# EAGLE design capstone electrical circuit (EAGLE 9.6.2)
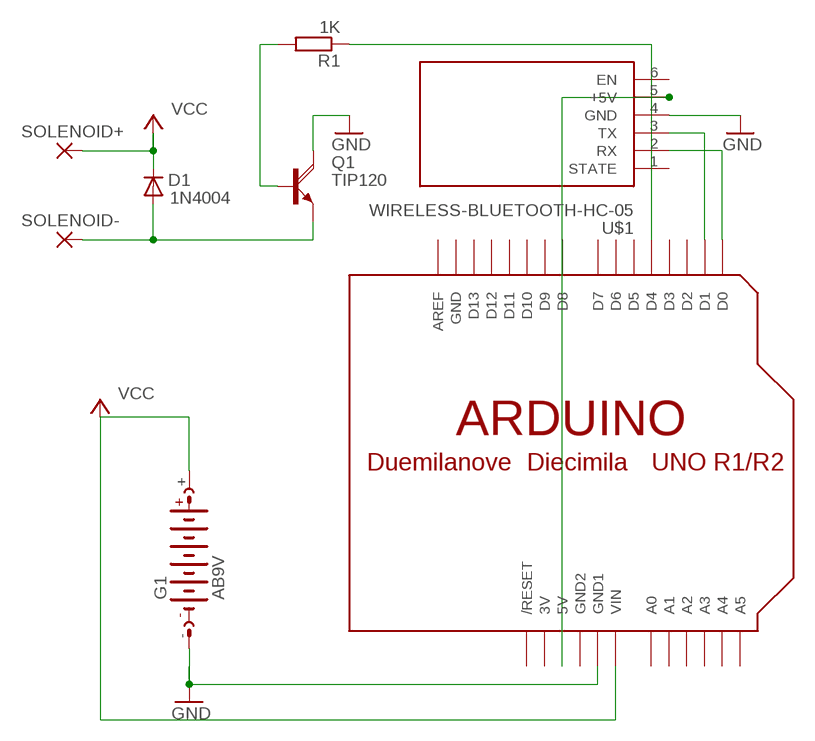
[diagram p0: schematic, sheet 1]

## Parts
D1  1N4004  [DO41-10]
G1  AB9V  [AB9V]
Q1  TIP120  [TO220AH]
R1  1K  R-EU_0207/10  [0207/10]
SOLENOID+  WIREPAD2,54/1,0  [2,54/1,0]
SOLENOID-  WIREPAD2,54/1,0  [2,54/1,0]
U$1  WIRELESS-BLUETOOTH-HC-05  [WIRELESS-BLUETOOTH-HC-05]
U$2  ARDUINOUNO  [ARDUINO]

## Nets
GND: G1.- Q1.C U$1.4(GND) U$2.GND1
N$1: U$1.2(RX) U$2.D0
N$2: U$1.3(TX) U$2.D1
N$3: D1.A Q1.E SOLENOID-.1(P)
N$4: U$1.5(+5V) U$2.5V
N$5: Q1.B R1.2
N$6: R1.1 U$2.D4
VCC: D1.C G1.+ SOLENOID+.1(P) U$2.VIN
Unconnected: U$1.1(STATE) U$1.6(EN) U$2.A0 U$2.A1 U$2.A2 U$2.A3 U$2.A4 U$2.A5 U$2.AREF U$2.D2 U$2.D3 U$2.D5 U$2.D6 U$2.D7 U$2.D8 U$2.D9 U$2.D10 U$2.D11 U$2.D12 U$2.D13 U$2.RESET(/RESET)

## Power pins joined to a net without a drawn wire
3V: U$2.3V
GND: U$2.GND
GND2: U$2.GND2

## Library data of the parts
D1 = adafruit:1N4004: DIODE General purpose 1N400x type rectifier (With bigger pads) http://www.ladyada.net/library/pcb/eaglelibrary.html
G1 = battery:AB9V: 9-V BATTERY CLIP
Q1 = transistor-power:TIP120: NPN DARLINGTON TRANSISTOR
R1 = rcl:R-EU_: RESISTOR, European symbol; SPICEPREFIX: R
SOLENOID+ SOLENOID- = wirepad:WIREPAD: Wire PAD connect wire on PCB
U$1 = diy-modules:WIRELESS-BLUETOOTH-HC-05: Bluetooth Transceiver Module based on HC-05 board Tutorial is available here: https://arduino-info.wikispaces.com/BlueTooth-HC05-HC06-Modules-How-To Click here to find device on ebay.com <http://www.ebay.com/sch/hc-05+module+rs232>
U$2 = adafruit:ARDUINO: Arduino Diecimila/Duemilanove Make a shield with ease, this package has all the named pins as well as the two mounting drill holes and an outline of the USB and DC power connector. The outline is on the DIMENSION layer, so if your board house uses it they will cut the outline to match. http://www.ladyada.net/library/pcb/eaglelibrary.html

## Board
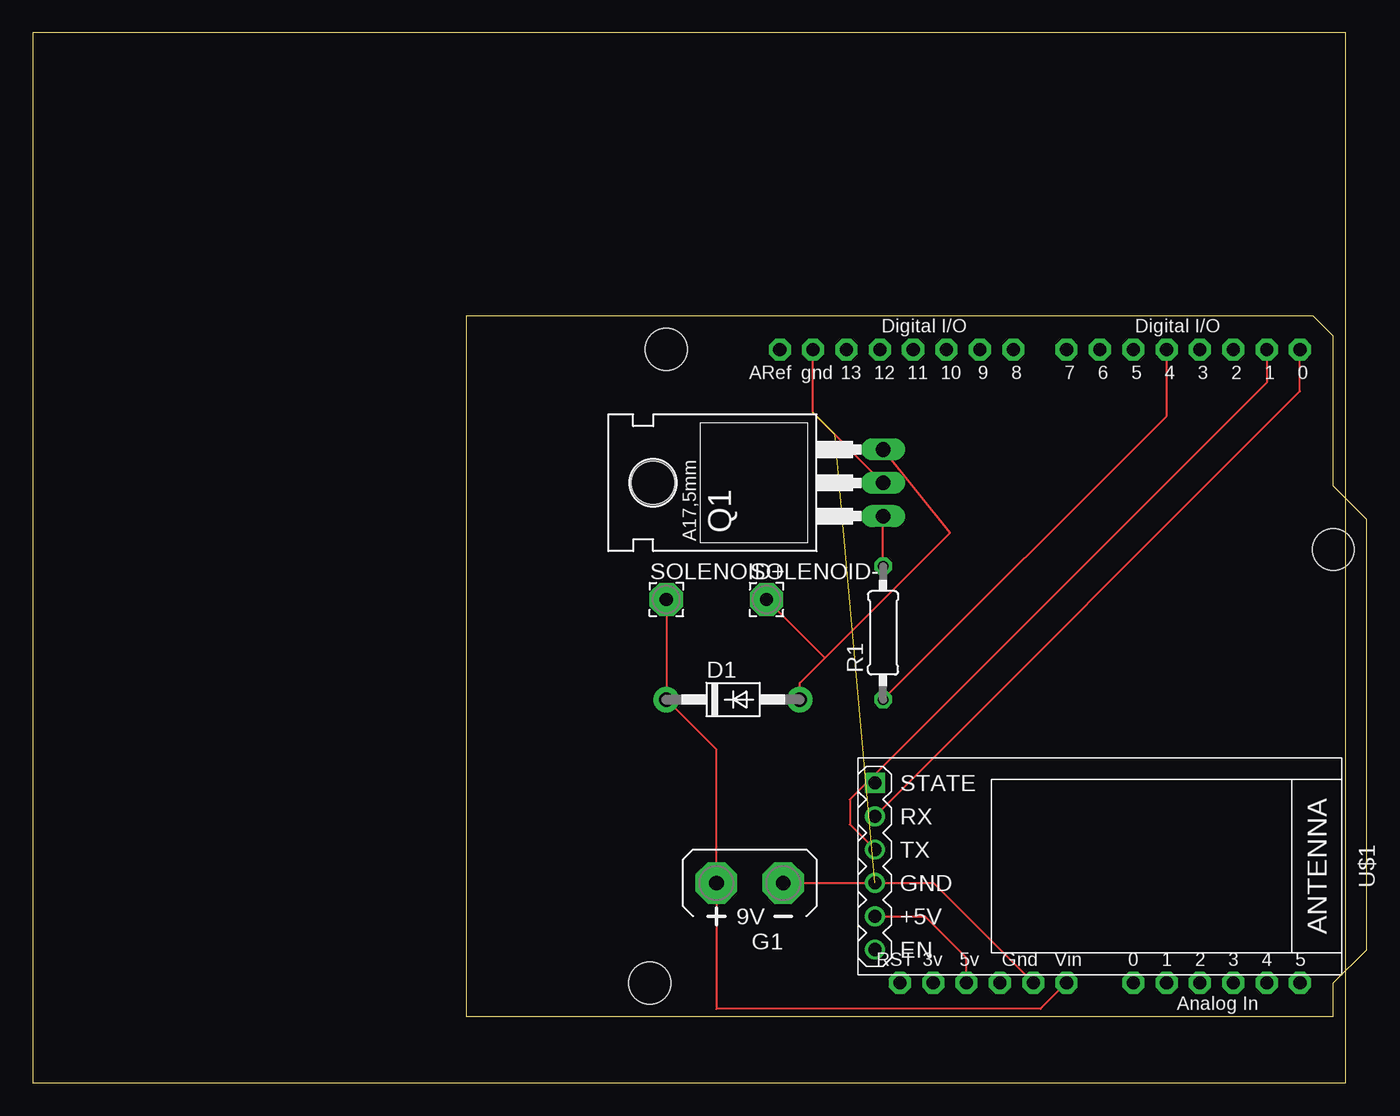
[diagram p1: board, top side]

Size 100 x 80 mm. Coordinates in mm from the lower left corner, seen from the top.
Outline: 0,0 100,0 100,80 0,80 0,0
Copper layers (1*16): Top 0.035mm / dielectric 1.5mm / Bottom 0.035mm
Design rules "default": minimum track width 6mil, minimum drill 0.35mm, track to track 6mil, track to pad 6mil, pad to pad 6mil, via to via 6mil, smd to smd 6mil, copper to edge 40mil, drill to drill 6mil, minimum pad ring 10mil, minimum via ring 8mil, stop-mask expansion 4mil, vias tented up to drill 0mil, thermal gap 10mil

### Footprints (pad centres in the part's own frame; a part is rotated, then mirrored left to right if it is on the bottom)
DO41-10 = drill 1.118 pad 1.93: A 5.08,0; C -5.08,0
AB9V = drill 1.118 pad 3.15 octagon: + 0,2.54; - 0,-2.54
TO220AH = drill 1.118 long: B -2.54,-6.35; C 0,-6.35; E 2.54,-6.35 | hole 3.302: 0,11.176
0207/10 = drill 0.813 octagon: 1 -5.08,0; 2 5.08,0
2,54/1,0 = drill 1.016 pad 2.54 octagon: 1 0,0
WIRELESS-BLUETOOTH-HC-05 = drill 1 square: 1 -6.35,-17.145 | drill 1: 2 -3.81,-17.145; 3 -1.27,-17.145; 4 1.27,-17.145; 5 3.81,-17.145; 6 6.35,-17.145
ARDUINO = drill 1 pad 1.676 octagon: 3V 35.56,2.54; 5V 38.1,2.54; A0 50.8,2.54; A1 53.34,2.54; A2 55.88,2.54; A3 58.42,2.54; A4 60.96,2.54; A5 63.5,2.54; AREF 23.876,50.8; D0 63.5,50.8; D1 60.96,50.8; D2 58.42,50.8; D3 55.88,50.8; D4 53.34,50.8; D5 50.8,50.8; D6 48.26,50.8; D7 45.72,50.8; D8 41.656,50.8; D9 39.116,50.8; D10 36.576,50.8; D11 34.036,50.8; D12 31.496,50.8; D13 28.956,50.8; GND 26.416,50.8; GND1 43.18,2.54; GND2 40.64,2.54; RESET 33.02,2.54; VIN 45.72,2.54 | hole 3.2: 15.24,50.8; 66.04,35.56; 13.97,2.54

### Placement (x,y rotation side)
D1  53.34,29.21 0 top
G1  54.61,15.24 90 top
Q1  58.42,45.72 90 top
R1  64.77,34.29 90 top
SOLENOID+  48.26,36.83 0 top
SOLENOID-  55.88,36.83 0 top
U$1  81.28,16.51 270 top
U$2  33.02,5.08 0 top

### Tracks (layer width: path | path; a pad name or v marks a point on that pad's centre or on a via)
GND  (2 unrouted)
  Top 0.152: G1.- U$1.4 68.58,15.24 U$2.GND1 | Q1.C 59.44,51.05 U$2.GND
N$1
  Top 0.152: U$1.2 96.52,52.7 U$2.D0
N$2
  Top 0.152: U$2.D1 93.98,53.34 62.23,21.59 62.23,19.68 U$1.3
N$3
  Top 0.152: Q1.E 69.85,41.91 60.33,32.38 | 60.33,32.38 58.42,30.48 D1.A | 60.33,32.38 SOLENOID-.1
N$4
  Top 0.152: U$1.5 67.94,12.7 71.12,9.53 U$2.5V
N$5
  Top 0.152: R1.2 Q1.B
N$6
  Top 0.152: R1.1 86.36,50.8 U$2.D4
VCC
  Top 0.152: U$2.VIN 76.76,5.64 52.07,5.64 G1.+ 52.07,25.4 D1.C SOLENOID+.1